# Altium schematic sheet STEP-UP.SchDoc: =DocumentName
size A4; CompanyName: "AS Manufacturing" LLC; Organization: "AS Manufacturing" LLC; Address1: 5 Sklyarenka St.; Address2: Kyiv 04073; Address3: Ukraine; Address4: https://ajax.systems/en/; DocumentNumber: 2; SheetNumber: 2; SheetTotal: 7; Template_version: 1.0.1
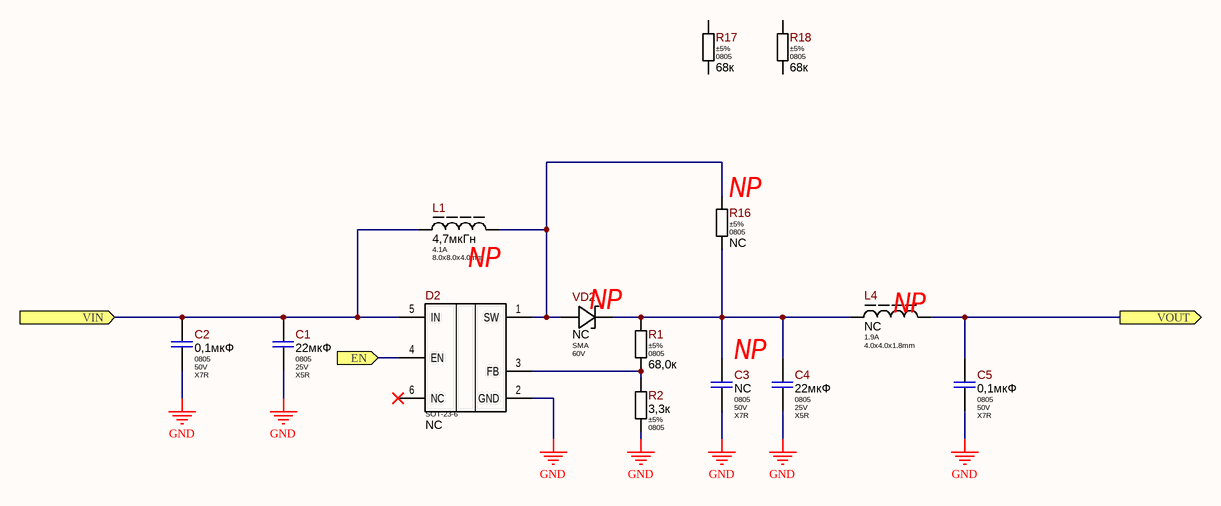
[diagram p0: STEP-UP.SchDoc]

## Parts
C1  value 22мкФ  Package: 0805  Voltage: 25V  Dielectric Type: X5R  [CAP-0805(2012)X125T20]  (hidden comment: 22uF)
C2  value 0,1мкФ  Package: 0805  Voltage: 50V  Dielectric Type: X7R  [CAP-0805(2012)X85T10]  (hidden comment: 0.1uF)
C3  value NC  Package: 0805  Voltage: 50V  Dielectric Type: X7R  [CAP-0805(2012)X85T10]  (hidden comment: 0.1uF)
C4  value 22мкФ  Package: 0805  Voltage: 25V  Dielectric Type: X5R  [CAP-0805(2012)X125T20]  (hidden comment: 22uF)
C5  value 0,1мкФ  Package: 0805  Voltage: 50V  Dielectric Type: X7R  [CAP-0805(2012)X85T10]  (hidden comment: 0.1uF)
D2  Package: SOT-23-6  Part Number: NC  [MT3608_MED]  (hidden comment: MT3608)
L1  value 4,7мкГн  Current: 4.1A  Package: 8.0x8.0x4.0mm  [SWPA8040S-Series]  (hidden comment: 4.7uH)
L4  value NC  Current: 1.9A  Package: 4.0x4.0x1.8mm  [SRN4018-Series_1.8mm]  (hidden comment: 4.7uH)
R1  value 68,0к  Tolerance: ±5%  Package: 0805  [R_ANY_CHIP_0805_MED]  (hidden comment: 68k)
R2  value 3,3к  Tolerance: ±5%  Package: 0805  [R_ANY_CHIP_0805_MED]  (hidden comment: 3,3k)
R16  value NC  Tolerance: ±5%  Package: 0805  [R_ANY_CHIP_0805_MED]  (hidden comment: 68k)
R17  value 68к  Tolerance: ±5%  Package: 0805  [R_ANY_CHIP_0805_MED]  (hidden comment: 68k)
R18  value 68к  Tolerance: ±5%  Package: 0805  [R_ANY_CHIP_0805_MED]  (hidden comment: 68k)
VD2  Part Number: NC  Package: SMA  Voltage: 60V  [SMA_MED]  (hidden comment: SK56A-LTP)

## Ports
EN (in), VIN (in), VOUT (out)

## Nets
GND: C1.2 C2.2 C3.2 C4.2 C5.2 D2.2(GND) R2.2
EN: D2.4(EN) ; port EN
VIN: C1.1 C2.1 D2.5(IN) L1.1 ; port VIN
VOUT: C5.1 L4.2 ; port VOUT
NetC3_1: C3.1 C4.1 L4.1 R1.1 R16.2 VD2.CA
NetD2_1: D2.1(SW) L1.2 R16.1 VD2.AN
NetD2_3: D2.3(FB) R1.2 R2.1

Not connected (* = marked no-connect by the designer): D2 6(NC)*; R17 1 2; R18 1 2

## Notes on the sheet
- NP
- (near R16) NP
- (near L1) NP
- (near VD2) NP
- (near L4) NP
- Title
- Product:
- Project:
- Size:
- Date:
- Variant:
- A4
- Authors:
- Time:
- Sheet
- of
- Revision:
- @Vitech_ua
- Commit:

## Library data of the parts
C1 C4 = CL21A226MAYNNNE: 22uF 25V X5R ±20% 0805 Ceramic Capacitor RoHS; Manufacturer: Samsung Electro-Mechanics; Ajax_1C_ID: 35089; Ajax_1C_PN: 22uF 25V X5R 20% 0805 CL21A226MAYNNNE Ceramic Capacitor SMD RoHS; Ajax_1С_Status: Mass Production; Standard Lead Time: 24 Weeks; Component Status: Released; Replacement: NONE; GUID_1C: e78293ef-273d-11ec-ab76-0050569f2651; Part Number: CL21A226MAYNNNE; Part Type: Ceramic / X5R / 0805; Component Type: SMD; Temperature Range: -55°C ~ 85°C; Tolerance: ±20%; ComponentLink1URL: https://eu.mouser.com/datasheet/2/585/MLCC-1837944.pdf; Supplier 1: Mouser; Supplier Part Number 1: 187-CL21A226MAYNNNE; Price: 0.02; ComponentLink1Description: Datasheet
C2 C3 C5 = CL21B104KBCNNNC: 100nF 50V X7R ±10% 0805 Ceramic Capacitor RoHS; Manufacturer: Samsung Electro-Mechanics; Ajax_1C_ID: 1251; Ajax_1C_PN: 100nF 50V X7R 10% 0805 CL21B104KBCNNNC Ceramic Capacitor SMD RoHS; Ajax_1С_Status: Mass Production; Standard Lead Time: 22 Weeks; Component Status: Released; Replacement: NONE; GUID_1C: 2c368b99-dd41-11e0-af93-6c626deda1bb; Part Number: CL21B104KBCNNNC; Part Type: Ceramic / X7R / 0805; Component Type: SMD; Temperature Range: -55°C ~ 125°C; Tolerance: ±10%; ComponentLink1URL: https://media.digikey.com/pdf/Data%20Sheets/Samsung%20PDFs/CL_Series_MLCC_ds.pdf; Supplier 1: Digi-Key; Supplier Part Number 1: 1276-1003-2-ND; Price: 0,00700031; ComponentLink1Description: Datasheet
D2 = MT3608: 2V-24V Input High Efficiency 1.2MHz 2A Step Up Converter; Manufacturer: Aerosemi; Ajax_1C_ID: 8101; Ajax_1C_PN: MT3608 Aerosemi 2A Step Up Converter IC SOT-23-6; Ajax_1С_Status: Mass Production; Standard Lead Time: NONE; Component Status: Released; GUID_1C: 8b925ac5-fc04-11e5-817b-d8cb8a9acc66; Lifecycle: Not Recommended; Part Type: Power / DC-DC / Boost; Component Type: SMD; Temperature Range: -40°C ~ 85°C; ComponentLink1URL: https://www,olimex,com/Products/Breadboarding/BB-PWR-3608/resources/MT3608,pdf; Replacement: NONE; Price: 0,12; ComponentLink1Description: Datasheet
L1 = SWPA8040S4R7NT: 4.7uH Magnetic-Resin Shielded Wirewound Inductor 4.1 A 25mOhm Max; Manufacturer: Shenzhen Sunlord Electronics; Ajax_1C_ID: 85672; Ajax_1C_PN: 4.7uH 30% 4.1A 25mOhm Max SWPA8040S4R7NT SMD Power Inductor; Ajax_1С_Status: RND Only; Saturation Current: 5.9A; Tolerance: ±30%; Component Status: Released; Standard Lead Time: 16 Weeks; Replacement: NONE; GUID_1C: 9a5367f7-7c8d-11ee-a921-00505699469b; Part Number: SWPA8040S4R7NT; Part Type: Power / Ferrite Core; Component Type: SMD; Temperature Range: -40°C ~ 125°C; ComponentLink1URL: \\altiumdb.ajax.local\files\Datasheet\Inductors\SWPA_Series_of_SMD_Power_Inductor.pdf; Supplier 1: Digi-Key; Supplier Part Number 1: 3442-SWPA8040S4R7NTTR-ND; Price: 0,83075; ComponentLink1Description: Datasheet
L4 = SRN4018-4R7M: 4.7uH Semi-Shielded Wirewound Inductor 1.9A 84mOhm Max; Manufacturer: Bourns Inc; Ajax_1C_ID: 20972; Ajax_1C_PN: 4.7uH SRN4018-4R7M SMD Индуктивность; Ajax_1С_Status: Mass Production; Saturation Current: 2A; Tolerance: ±20%; Component Status: Released; Standard Lead Time: 42 Weeks; Replacement: NONE; GUID_1C: 7ba8f5fd-b629-11ea-ab61-0050569f2651; Part Number: SRN4018-4R7M; Part Type: Power / Ferrite Core; Component Type: SMD; Temperature Range: -25°C ~ 120°C; ComponentLink1URL: https://eu.mouser.com/datasheet/2/54/srn4018-1391320.pdf; Supplier 1: Mouser; Supplier Part Number 1: 652-SRN4018-4R7M; Price: 0.09851659; ComponentLink1Description: Datasheet
R1 R16-R18 = RC0805JR-072K2L: 2.2 kOhms ±5% 1/8W 0805 Thick Film Resistor; Manufacturer: Yageo; Ajax_1C_ID: 26119; Ajax_1C_PN: 2.2k 5% 0805 Resistors SMD RoHS; Ajax_1С_Status: RND Only; Power Rating: 0.125W; Voltage: 150V; Component Status: Released; Temperature Stability: ±100ppm/°C; Replacement: NONE; GUID_1C: 80325ec8-617a-11eb-ab6f-0050569f2651; Part Number: RC0805JR-072K2L; Component Type: SMD; Part Type: Thick Film; Temperature Range: -55°C ~ 155°C; ComponentLink1URL: https://eu.mouser.com/datasheet/2/447/PYu_RC_Group_51_RoHS_L_11-1984063.pdf; Supplier 1: Digi-Key; Supplier Part Number 1: 311-2.2KARTR-ND; Price: 0,005; ComponentLink1Description: Datasheet
R2 = RC0805JR-073K3L: 3.3 kOhms ±5%, 1/8W 0805 Thick Film Resistor; Manufacturer: Yageo; Ajax_1C_ID: 9030; Ajax_1C_PN: 3.3k 5% 0805 Resistors SMD RoHS; Ajax_1С_Status: RND Only; Power Rating: 0.125W; Voltage: 150V; Component Status: Released; Temperature Stability: ±100ppm/°C; Replacement: NONE; GUID_1C: cb9785ec-9b47-11e6-8242-d8cb8a9acc66; Part Number: RC0805JR-073K3L; Component Type: SMD; Part Type: Thick Film; Temperature Range: -55°C ~ 155°C; ComponentLink1URL: https://eu.mouser.com/datasheet/2/447/PYu_RC_Group_51_RoHS_L_10-1664068.pdf; Price: 0,001081; ComponentLink1Description: Datasheet
VD2 = SK56A-LTP: Diode Schottky 60V 5A, SMA; Manufacturer: Micro Commercial Components; Ajax_1C_ID: 12747; Ajax_1C_PN: SK56A-LTP диод; Ajax_1С_Status: Mass Production; Marking: SK56A; Component Status: Released; Standard Lead Time: 12 Weeks; Vf: 750mV @ 5A; Replacement: NONE; GUID_1C: b92aa543-5aa4-11e8-ab3c-0050569f2651; Part Type: Schottky; Component Type: SMD; Current: 5A; Temperature Range: -55°C ~ 150°C; ComponentLink1URL: https://www.mccsemi.com/pdf/Products/SK52A-L-SK510A-L(DO-214AC).pdf; Supplier 1: Digi-Key; Supplier Part Number 1: SK56A-LTPMSTR-ND; Price: 0,06; ComponentLink1Description: Datasheet